# EAGLE design dronesel3 (EAGLE 9.6.2)
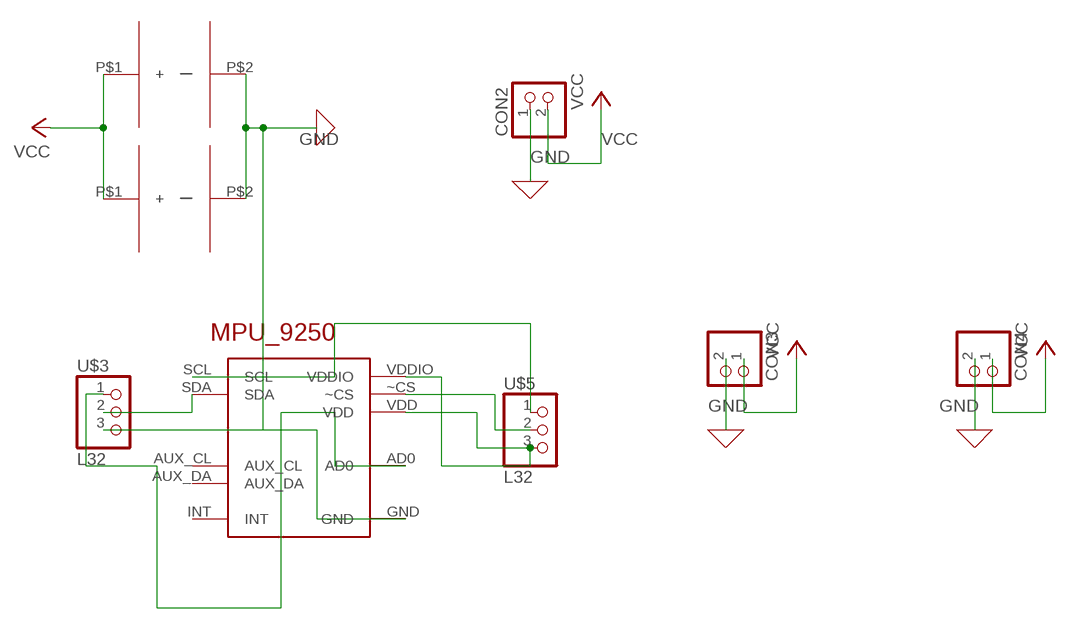
[diagram p0: schematic, sheet 1]

## Parts
CON2  L2  [L_2]
CON3  L2  [L_2]
CON4  L2  [L_2]
MPU9250  MPU_9250  [MPU_9250]
U$1  VEC5R4355QG-I  [VEC5R4355QG-I]
U$2  VEC5R4355QG-I  [VEC5R4355QG-I]
U$3  L32  [L_32]
U$5  L32  [L_32]

## Nets
GND: CON2.1 CON3.2 CON4.2 MPU9250.GND U$1.P$2(ー) U$2.P$2(ー) U$3.3
N$2: MPU9250.VDD MPU9250.VDDIO U$5.3
N$4: MPU9250.~CS U$5.2
N$5: MPU9250.SCL U$5.1
N$6: MPU9250.AD0 U$3.1
N$7: MPU9250.SDA U$3.2
VCC: CON2.2 CON3.1 CON4.1 U$1.P$1(+) U$2.P$1(+)
Unconnected: MPU9250.AUX_CL MPU9250.AUX_DA MPU9250.INT

## Library data of the parts
CON2-CON4 = CREATE_sensor_dip:L2
MPU9250 = CREATE_sensor_dip:MPU_9250
U$1 U$2 = sel:VEC5R4355QG-I
U$3 U$5 = CREATE_sensor_dip:L32

## Board
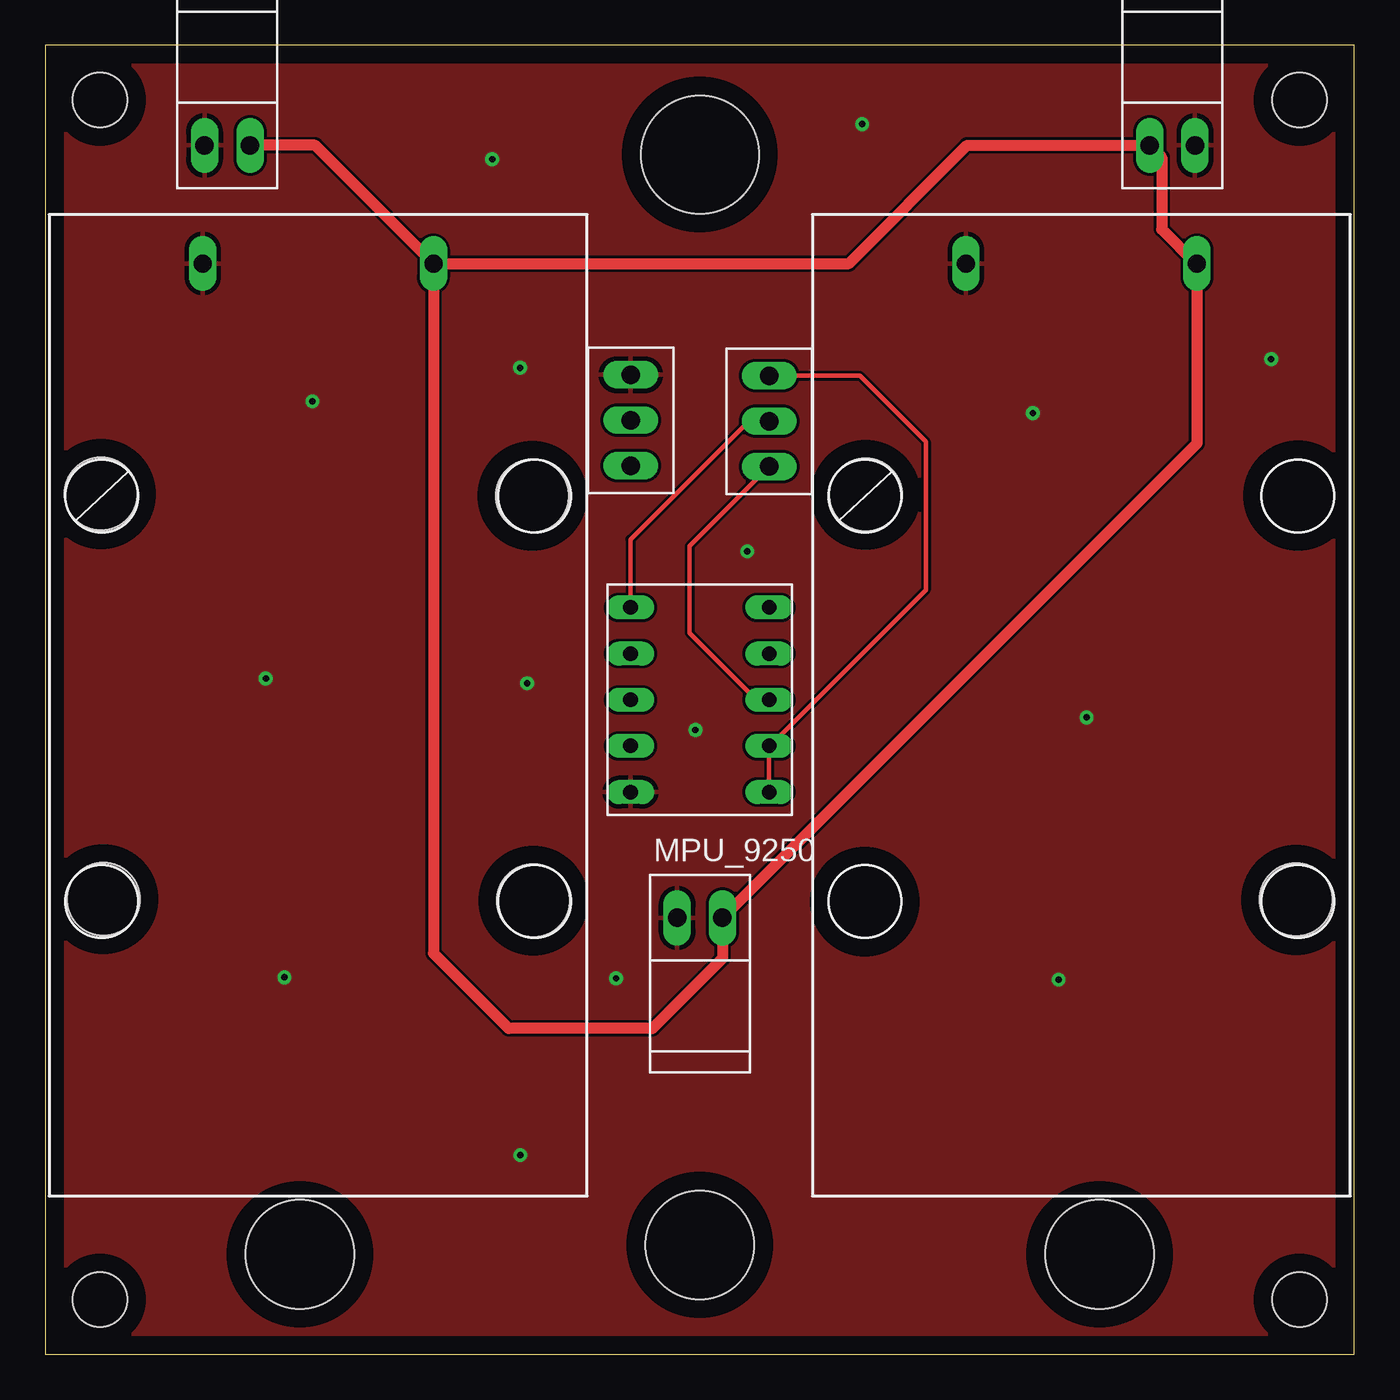
[diagram p1: board, top side]
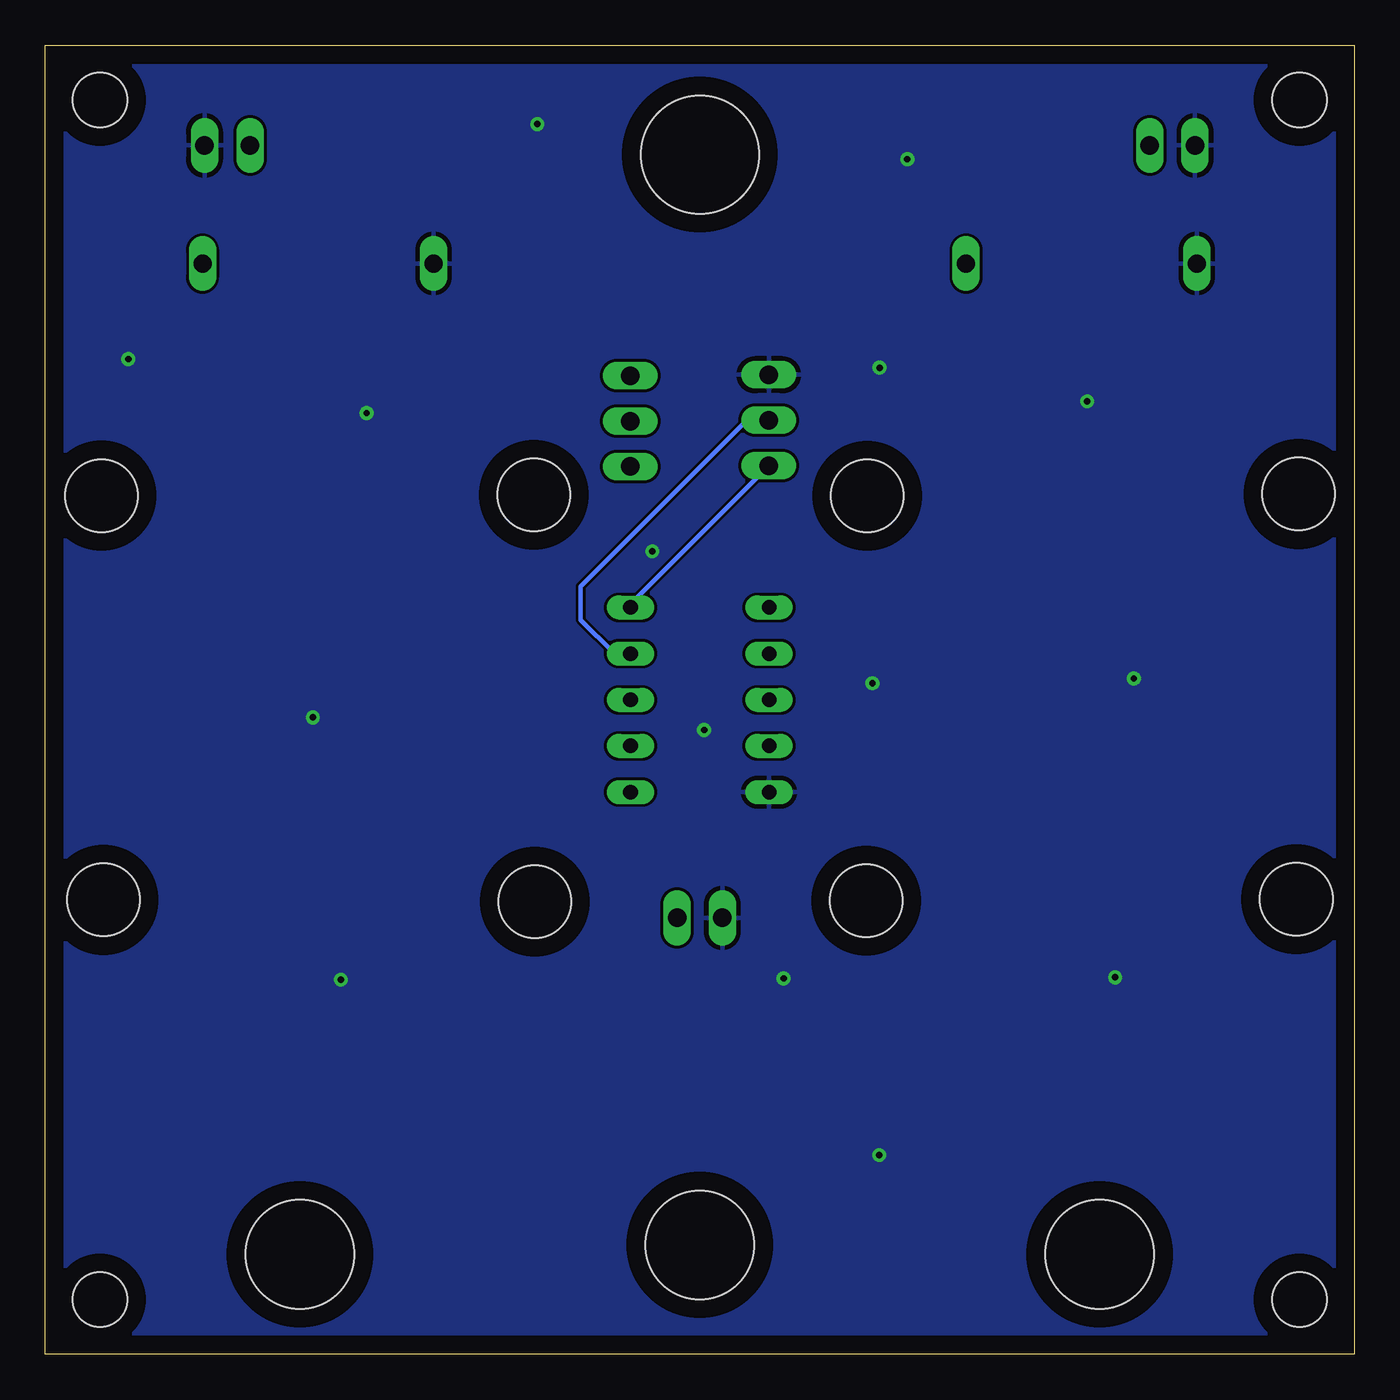
[diagram p2: board, bottom side, seen from below]

Size 72 x 72 mm. Coordinates in mm from the lower left corner, seen from the top.
Outline: 0,0 72,0 72,72 0,72 0,0
Copper layers (1*16): Top 0.035mm / dielectric 1.5mm / Bottom 0.035mm
Design rules "default": minimum track width 6mil, minimum drill 0.35mm, track to track 6mil, track to pad 6mil, pad to pad 6mil, via to via 6mil, smd to smd 6mil, copper to edge 40mil, drill to drill 6mil, minimum pad ring 10mil, minimum via ring 8mil, stop-mask expansion 4mil, vias tented up to drill 0mil, thermal gap 10mil
Holes 4 mm at 3.05,47.32 26.79,47.22 3.18,25.02 26.84,24.95 45.07,24.89 45.13,47.27 68.92,47.23 68.81,24.99
Holes 6.5 mm at 36,66
Holes 6 mm at 58,5.5 14,5.5 36,6
Holes 3 mm at 3,3 69,3 69,69 3,69

### Footprints (pad centres in the part's own frame; a part is rotated, then mirrored left to right if it is on the bottom)
L_2 = drill 1.016 long: 1 1.25,0; 2 -1.25,0
MPU_9250 = drill 0.8 long: AD0 -3.81,-5.08; AUX_CL 3.81,-2.54; AUX_DA 3.81,0; GND 3.81,5.08; INT 3.81,2.54; SCL -3.81,0; SDA -3.81,-2.54; VDD -3.81,5.08; VDDIO -3.81,2.54; ~CS 3.81,-5.08
VEC5R4355QG-I = drill 1 long: P$1 0,6.35; P$2 0,-6.35
L_32 = drill 1.016 long: 1 2.5,0; 2 0,0; 3 -2.5,0

### Placement (x,y rotation side)
CON2  10,66.5 180 top
CON3  36,24 0 top
CON4  62,66.5 180 top
MPU9250  36,36 180 top
U$1  57,60 270 top
U$2  15,60 270 top
U$3  32.2,51.38 270 top
U$5  39.82,51.33 270 top

### Tracks (layer width: path | path; a pad name or v marks a point on that pad's centre or on a via)
GND  (via drill 0.35)
  other vias: 12.12,37.17 26.5,36.91 57.29,35.03 54.33,51.77 14.69,52.42 13.15,20.73 55.74,20.6 31.39,20.67 26.13,10.95 26.11,54.27 24.58,65.74 44.94,67.67 67.44,54.74 38.61,44.17 35.76,34.34
  pour Top: -2,76.6 -2,-2.45 76.6,-2.45 76.6,76.6
  pour Bottom: -3.3,78.45 -3.3,-4.4 78,-4.4 78,78.45
N$2
  Top 0.254: U$5.3 44.81,53.83 48.44,50.2 48.44,42.05 39.85,33.46 MPU9250.VDDIO MPU9250.VDD
N$4
  Top 0.254: U$5.2 38.7,51.33 32.19,44.82 MPU9250.~CS
N$5
  Top 0.254: U$5.1 35.44,44.45 35.44,39.68 39.12,36 MPU9250.SCL
N$6
  Bottom 0.254: U$3.1 39.81,41.27 MPU9250.AD0
N$7
  Bottom 0.254: U$3.2 33.41,51.38 42.55,42.24 42.55,40.4 40.69,38.54 MPU9250.SDA
VCC
  Top 0.61: U$2.P$1 44.21,60 50.71,66.5 CON4.1 61.41,65.84 61.41,61.88 63.29,60 U$1.P$1 63.35,50.1 CON3.1 37.25,21.77 33.39,17.91 25.49,17.91 21.35,22.05 U$2.P$1 | U$2.P$1 14.85,66.5 CON2.2